# Altium schematic sheet Connectors.SchDoc
size A; SheetNumber: 4; SheetTotal: 6
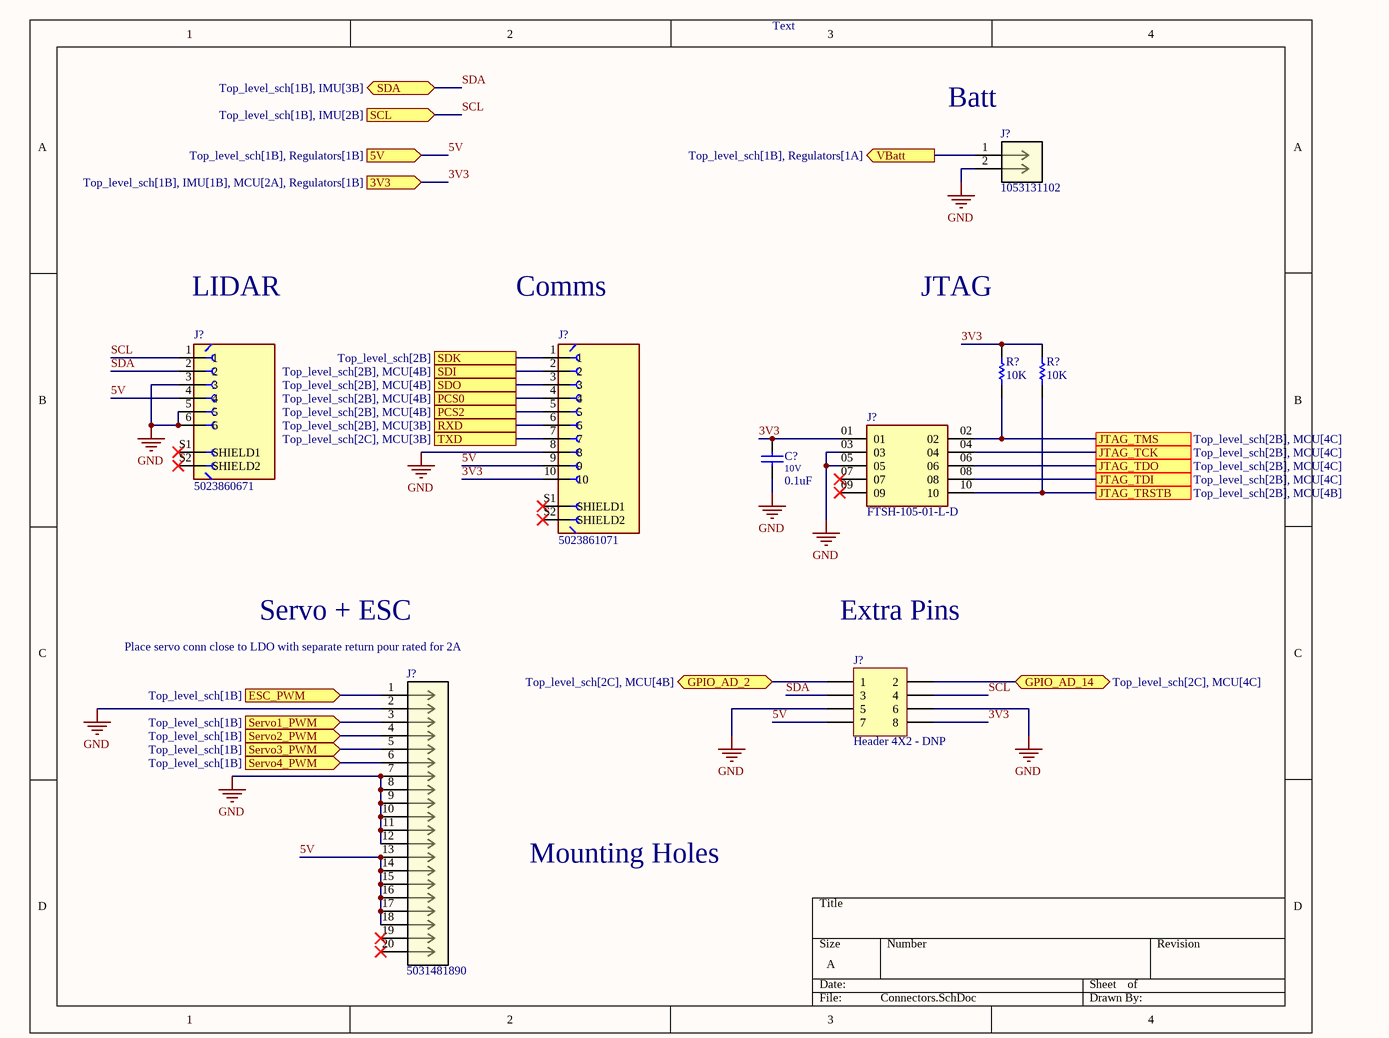
[diagram p0: Connectors.SchDoc]

## Parts
(Parts that share a designator on the sheet are numbered #1, #2 ... from top to bottom, then left to right.)
C?  value 0.1uF  Voltage: 10V  (hidden comment: Capacitor)
J?#1  1053131102  [CON_1053131102]
J?#2  5023860671  [MOLEX_5023860671]
J?#3  5023861071  [MOLEX_5023861071]
J?#4  FTSH-105-01-L-D  [SAMTEC_FTSH-105-01-L-D]
J?#5  Header 4X2 - DNP  [HDR2X4]
J?#6  5031481890  [CON_5031481890_MOL]
R?#1  value 10K  (hidden comment: Resistor)
R?#2  value 10K  (hidden comment: Resistor)

## Ports
3V3 (in, see Top_level_sch[1B], IMU[1B], MCU[2A], Regulators[1B]), 5V (in, see Top_level_sch[1B], Regulators[1B]), ESC_PWM (in, see Top_level_sch[1B]), GPIO_AD_2 (bidir, see Top_level_sch[2C], MCU[4B]), GPIO_AD_14 (bidir, see Top_level_sch[2C], MCU[4C]), JTAG_TCK (see Top_level_sch[2B], MCU[4C]), JTAG_TDI (see Top_level_sch[2B], MCU[4C]), JTAG_TDO (see Top_level_sch[2B], MCU[4C]), JTAG_TMS (see Top_level_sch[2B], MCU[4C]), JTAG_TRSTB (see Top_level_sch[2B], MCU[4B]), PCS0 (see Top_level_sch[2B], MCU[4B]), PCS2 (see Top_level_sch[2B], MCU[4B]), RXD (see Top_level_sch[2B], MCU[3B]), SCL (in, see Top_level_sch[1B], IMU[2B]), SDA (bidir, see Top_level_sch[1B], IMU[3B]), SDI (see Top_level_sch[2B], MCU[4B]), SDK (see Top_level_sch[2B]), SDO (see Top_level_sch[2B], MCU[4B]), Servo1_PWM (in, see Top_level_sch[1B]), Servo2_PWM (in, see Top_level_sch[1B]), Servo3_PWM (in, see Top_level_sch[1B]), Servo4_PWM (in, see Top_level_sch[1B]), TXD (see Top_level_sch[2C], MCU[3B]), VBatt (out, see Top_level_sch[1B], Regulators[1A])

## Nets
GND: C?.1 J?#1.2 J?#2.3 J?#2.5 J?#2.6 J?#3.8 J?#4.03 J?#4.05 J?#5.5 J?#5.6 J?#6.2 J?#6.7 J?#6.8 J?#6.9 J?#6.10 J?#6.11 J?#6.12
3V3: C?.2 J?#3.10 J?#4.01 J?#5.8 R?#1.2 R?#2.2 ; port 3V3
5V: J?#2.4 J?#3.9 J?#5.7 J?#6.13 J?#6.14 J?#6.15 J?#6.16 J?#6.17 J?#6.18 ; port 5V
ESC_PWM: J?#6.1 ; port ESC_PWM
GPIO_AD_2: J?#5.1 ; port GPIO_AD_2
GPIO_AD_14: J?#5.2 ; port GPIO_AD_14
JTAG_TCK: J?#4.04 ; port JTAG_TCK
JTAG_TDI: J?#4.08 ; port JTAG_TDI
JTAG_TDO: J?#4.06 ; port JTAG_TDO
JTAG_TMS: J?#4.02 R?#1.1 ; port JTAG_TMS
JTAG_TRSTB: J?#4.10 R?#2.1 ; port JTAG_TRSTB
PCS0: J?#3.4 ; port PCS0
PCS2: J?#3.5 ; port PCS2
RXD: J?#3.6 ; port RXD
SCL: J?#2.1 J?#5.4 ; port SCL
SDA: J?#2.2 J?#5.3 ; port SDA
SDI: J?#3.2 ; port SDI
SDK: J?#3.1 ; port SDK
SDO: J?#3.3 ; port SDO
Servo1_PWM: J?#6.3 ; port Servo1_PWM
Servo2_PWM: J?#6.4 ; port Servo2_PWM
Servo3_PWM: J?#6.5 ; port Servo3_PWM
Servo4_PWM: J?#6.6 ; port Servo4_PWM
TXD: J?#3.7 ; port TXD
VBatt: J?#1.1 ; port VBatt

Not connected (* = marked no-connect by the designer): J?#2 S1(SHIELD1)* S2(SHIELD2)*; J?#3 S1(SHIELD1)* S2(SHIELD2)*; J?#4 07* 09*; J?#6 19* 20*

## Notes on the sheet
- Text
- (near J?#1) Batt
- LIDAR
- Comms
- JTAG
- (near J?#6) Place servo conn close to LDO with separate return pour rated for 2A
- Servo + ESC
- Extra Pins
- Mounting Holes

## Library data of the parts
C? = Capacitor: SimulationGenericComponent: True
J?#1 = 1053131102: No Description Available; Mfr_Name: Molex Connector Corporation; Copyright: Copyright (C) 2022 Ultra Librarian. All rights reserved.; Manufacturer_Part_Number: 1053131102; RefDes: RefDes; Type: DEV
J?#2 = 5023860671: 1.25mm Pitch CLIK-Mate Wire-to-Board PCB Receptacle, Single Row, Right-Angle, Gold (Au) Plating, 6 Circuits; MF: Molex; Availability: In Stock; Check_prices: https://www.snapeda.com/parts/5023860671/Molex/view-part/?ref=eda; Value: *; Package: None; MP: 5023860671; Price: None; SnapEDA_Link: https://www.snapeda.com/parts/5023860671/Molex/view-part/?ref=snap; Purchase-URL: https://pricing.snapeda.com/search/part/5023860671/?ref=eda
J?#3 = 5023861071: 1.25mm Pitch CLIK-Mate Wire-to-Board PCB Receptacle, Single Row, Right-Angle, Tin (Sn) Plating; Value: *; Package: None; MP: 5023861071; Price: None; Availability: Unavailable
J?#4 = FTSH-105-01-L-D: Connector Header Surface Mount 10 position 0.050 (1.27mm); MF: Samtec; Package: Connector Header Samtec; Purchase-URL: https://pricing.snapeda.com/search/part/FTSH-105-01-L-D/?ref=eda; Value: *; MP: FTSH-105-01-L-D; Availability: Good; Price: None
J?#5 = Header 4X2: Header, 4-Pin, Dual row; LatestRevisionDate: 17-Jul-2002; LatestRevisionNote: Re-released for DXP Platform.; Publisher: Altium Limited
J?#6 = 5031481890: No Description Available; Mfr_Name: Molex Connector Corporation; Copyright: Copyright (C) 2022 Ultra Librarian. All rights reserved.; Manufacturer_Part_Number: 5031481890; RefDes: RefDes; Type: DEV
R?#1 R?#2 = Resistor: TC1: 0; SimulationGenericComponent: True; TC2: 0